# EAGLE design project2 (EAGLE 9.6.2)
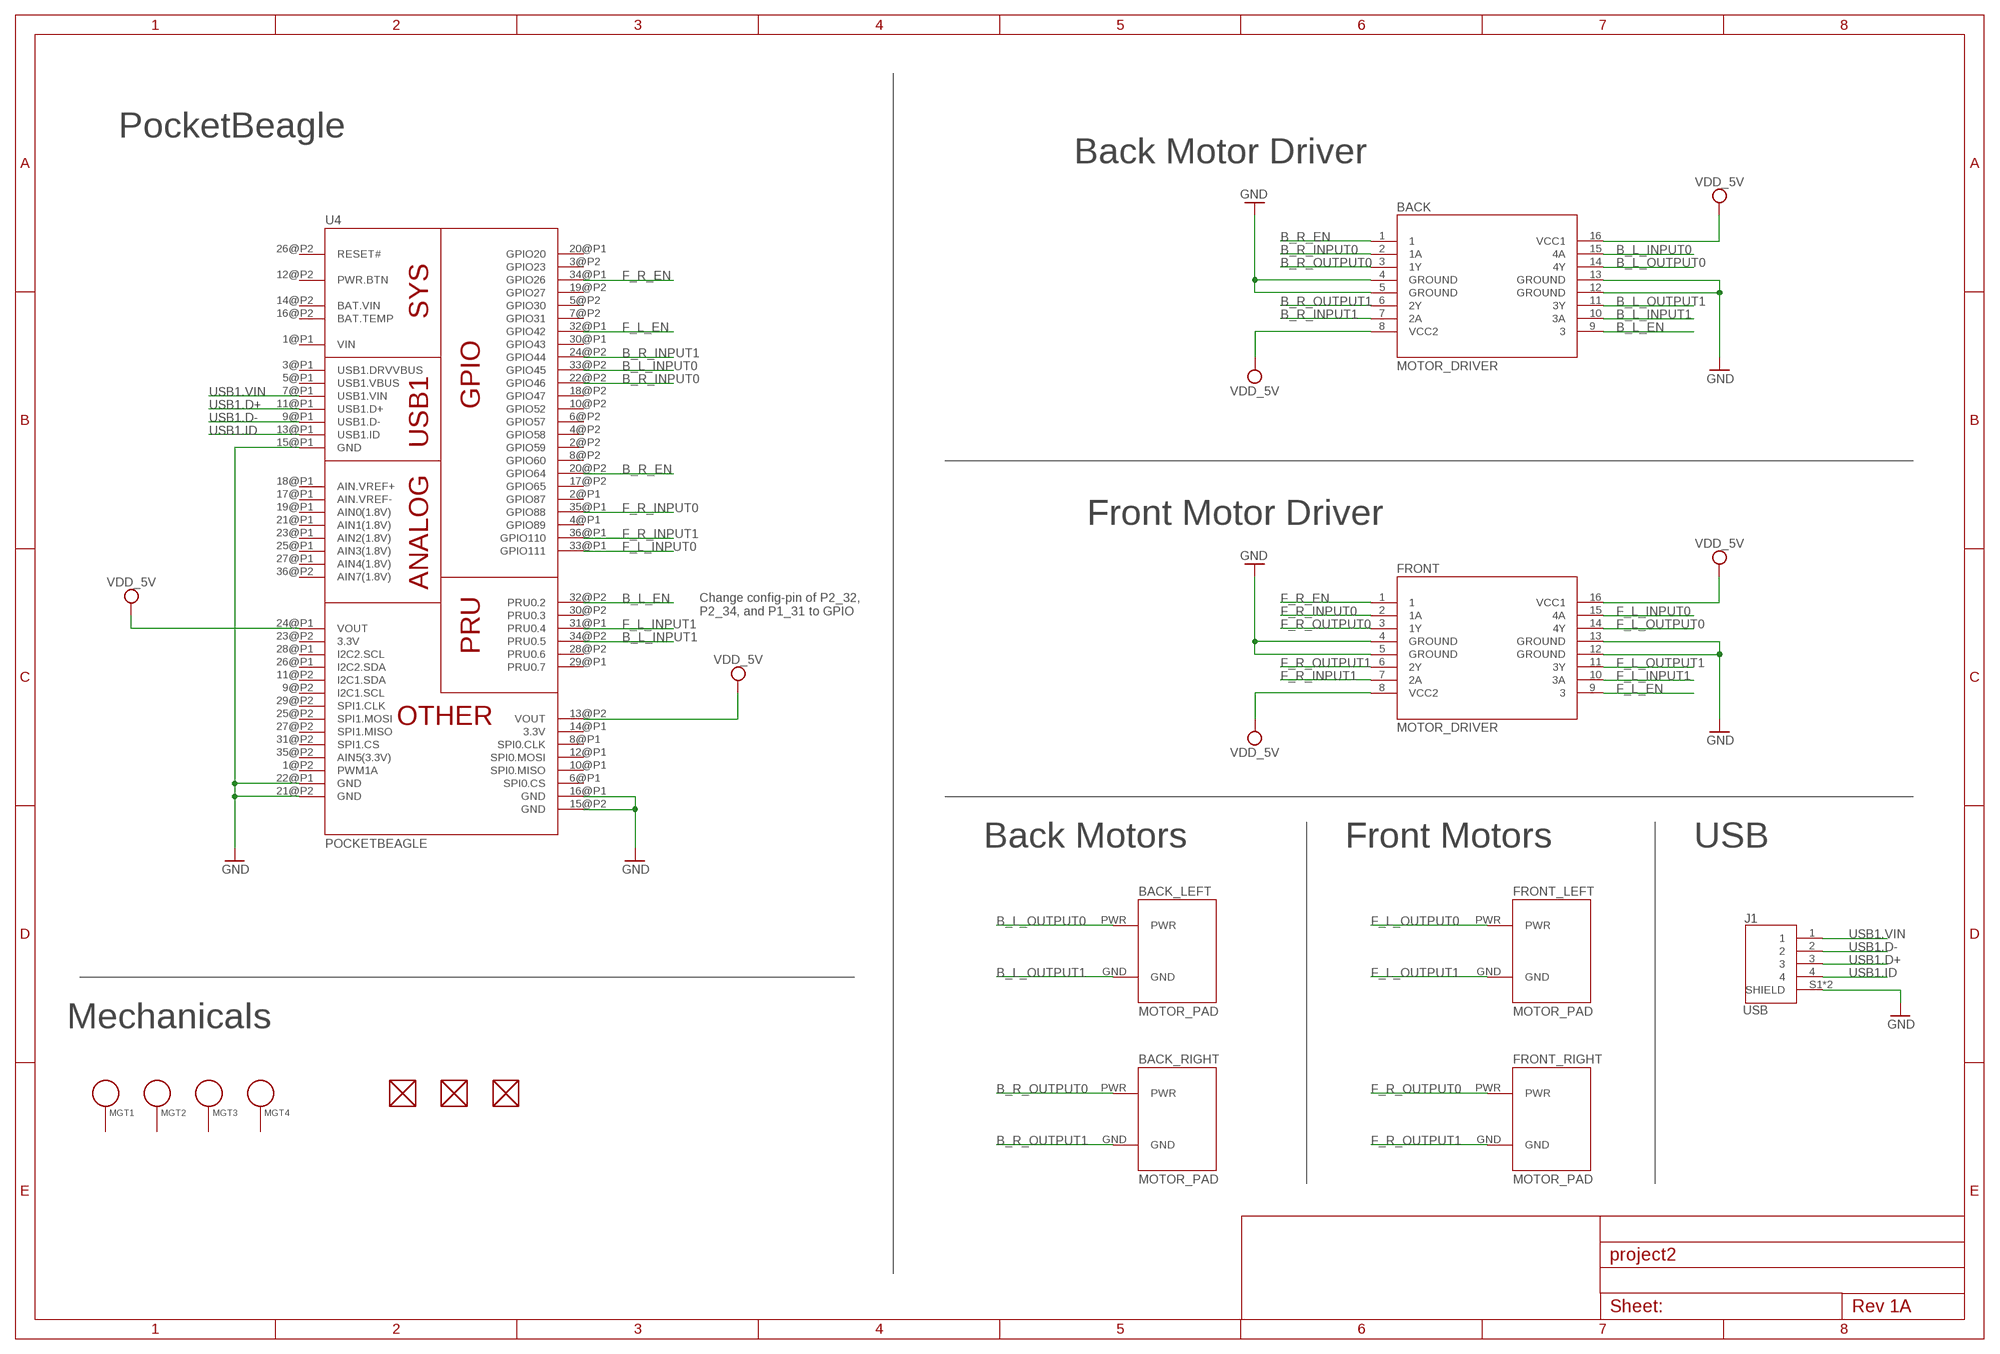
[diagram p0: schematic, sheet 1]

## Parts
BACK  MOTOR_DRIVER  [MOTOR_DRIVER]
BACK_LEFT  MOTOR_PAD  [MOTOR_PAD]
BACK_RIGHT  MOTOR_PAD  [MOTOR_PAD]
FRONT  MOTOR_DRIVER  [MOTOR_DRIVER]
FRONT_LEFT  MOTOR_PAD  [MOTOR_PAD]
FRONT_RIGHT  MOTOR_PAD  [MOTOR_PAD]
FUD1  FIDUCIAL  [FIDUCIAL_40MIL]
FUD2  FIDUCIAL  [FIDUCIAL_40MIL]
FUD3  FIDUCIAL  [FIDUCIAL_40MIL]
J1  USB  [J_SMD_292303-9-4_2,2.5_14.85_14.06_8.9]
MGT1  MOUNTING_HOLE  [MOUNTING_HOLE]
MGT2  MOUNTING_HOLE  [MOUNTING_HOLE]
MGT3  MOUNTING_HOLE  [MOUNTING_HOLE]
MGT4  MOUNTING_HOLE  [MOUNTING_HOLE]
U4  POCKETBEAGLE  [POCKETBEAGLE]

## Nets
B_L_EN: BACK.9 U4.32@P2(PRU0.2)
B_L_INPUT0: BACK.15(4A) U4.33@P2(GPIO45)
B_L_INPUT1: BACK.10(3A) U4.34@P2(PRU0.5)
B_L_OUTPUT0: BACK.14(4Y) BACK_LEFT.PWR
B_L_OUTPUT1: BACK.11(3Y) BACK_LEFT.GND
B_R_EN: BACK.1 U4.20@P2(GPIO64)
B_R_INPUT0: BACK.2(1A) U4.22@P2(GPIO46)
B_R_INPUT1: BACK.7(2A) U4.24@P2(GPIO44)
B_R_OUTPUT0: BACK.3(1Y) BACK_RIGHT.PWR
B_R_OUTPUT1: BACK.6(2Y) BACK_RIGHT.GND
F_L_EN: FRONT.9 U4.32@P1(GPIO42)
F_L_INPUT0: FRONT.15(4A) U4.33@P1(GPIO111)
F_L_INPUT1: FRONT.10(3A) U4.31@P1(PRU0.4)
F_L_OUTPUT0: FRONT.14(4Y) FRONT_LEFT.PWR
F_L_OUTPUT1: FRONT.11(3Y) FRONT_LEFT.GND
F_R_EN: FRONT.1 U4.34@P1(GPIO26)
F_R_INPUT0: FRONT.2(1A) U4.35@P1(GPIO88)
F_R_INPUT1: FRONT.7(2A) U4.36@P1(GPIO110)
F_R_OUTPUT0: FRONT.3(1Y) FRONT_RIGHT.PWR
F_R_OUTPUT1: FRONT.6(2Y) FRONT_RIGHT.GND
GND: BACK.4(GROUND) BACK.5(GROUND) BACK.12(GROUND) BACK.13(GROUND) FRONT.4(GROUND) FRONT.5(GROUND) FRONT.12(GROUND) FRONT.13(GROUND) J1.S1(SHIELD) J1.S2(SHIELD) U4.15@P1(GND) U4.15@P2(GND) U4.16@P1(GND) U4.21@P2(GND) U4.22@P1(GND)
USB1.D+: J1.3 U4.11@P1(USB1.D+)
USB1.D-: J1.2 U4.9@P1(USB1.D-)
USB1.ID: J1.4 U4.13@P1(USB1.ID)
USB1.VIN: J1.1 U4.7@P1(USB1.VIN)
VDD_5V: BACK.8(VCC2) BACK.16(VCC1) FRONT.8(VCC2) FRONT.16(VCC1) U4.13@P2(VOUT) U4.24@P1(VOUT)
Unconnected: FUD1.P$1 FUD2.P$1 FUD3.P$1 MGT1.P$1 MGT2.P$1 MGT3.P$1 MGT4.P$1 U4.1@P2(PWM1A) U4.2@P1(GPIO87) U4.2@P2(GPIO59) U4.3@P1(USB1.DRVVBUS) U4.3@P2(GPIO23) U4.4@P1(GPIO89) U4.4@P2(GPIO58) U4.5@P1(USB1.VBUS) U4.5@P2(GPIO30) U4.6@P1(SPI0.CS) U4.6@P2(GPIO57) U4.7@P2(GPIO31) U4.8@P1(SPI0.CLK) U4.8@P2(GPIO60) U4.9@P2(I2C1.SCL) U4.10@P1(SPI0.MISO) U4.10@P2(GPIO52) U4.11@P2(I2C1.SDA) U4.12@P1(SPI0.MOSI) U4.12@P2(PWR.BTN) U4.14@P1(3.3V) U4.16@P2(BAT.TEMP) U4.17@P1(AIN.VREF-) U4.17@P2(GPIO65) U4.18@P1(AIN.VREF+) U4.18@P2(GPIO47) U4.19@P1(AIN0(1.8V)) U4.19@P2(GPIO27) U4.20@P1(GPIO20) U4.21@P1(AIN1(1.8V)) U4.23@P1(AIN2(1.8V)) U4.23@P2(3.3V) U4.25@P1(AIN3(1.8V)) U4.25@P2(SPI1.MOSI) U4.26@P1(I2C2.SDA) U4.26@P2(RESET#) U4.27@P1(AIN4(1.8V)) U4.27@P2(SPI1.MISO) U4.28@P1(I2C2.SCL) U4.28@P2(PRU0.6) U4.29@P1(PRU0.7) U4.29@P2(SPI1.CLK) U4.30@P1(GPIO43) U4.30@P2(PRU0.3) U4.31@P2(SPI1.CS) U4.35@P2(AIN5(3.3V)) U4.36@P2(AIN7(1.8V))

## Notes on the sheet
- PocketBeagle
- Back Motor Driver
- Front Motor Driver
- Change config-pin of P2_32,
  P2_34, and P1_31 to GPIO
- Back Motors | Front Motors | USB
- Mechanicals

## Power pins joined to a net without a drawn wire
BAT.VIN: U4.14@P2(BAT.VIN)
VIN: U4.1@P1(VIN)

## Library data of the parts
BACK FRONT = project2:MOTOR_DRIVER; DATASHEET_URL: http://www.ti.com/lit/gpn/L293D; DESCRIPTION: Quadruple Half-H Drivers; FAMILY_NAME: PERIPHERAL DRIVER AND ACTUATOR; GENERIC_PART_NUMBER: L293D; INDUSTRY_STD_PKG_TYPE: PDIP; MANUFACTURER: Texas Instruments; PACKAGE_DESIGNATOR: NE; PIN_COUNT: 16
BACK_LEFT BACK_RIGHT FRONT_LEFT FRONT_RIGHT = project2:MOTOR_PAD
FUD1-FUD3 = project2:FIDUCIAL
J1 = project2:USB: Conn USB 2.0 Type A RCP 4 POS Solder RA SMD 4 Terminal 1 Port Automotive Box/Reel/Tray Check prices <https://pricing.snapeda.com/parts/292303-9/TE%20Connectivity/view-part?ref=eda>; AVAILABILITY: Good; CENTERLINE_PITCH: 2 mm[.078 in]; COMMENT: 292303-9; DESCRIPTION: Conn USB 2.0 Type A RCP 4 POS Solder RA Thru-Hole 4 Terminal 1 Port Automotive Tray; EU_ROHS_COMPLIANCE: Compliant; MF: TE Connectivity; MP: 292303-9; NUMBER_OF_POSITIONS: 4; PACKAGE: None; PRICE: None; PRODUCT_TYPE: Connector; PURCHASE-URL: https://pricing.snapeda.com/search/part/292303-9/?ref=eda
MGT1-MGT4 = project2:MOUNTING_HOLE: Chassis Mounting Hole w/GND connection ability
U4 = project2:POCKETBEAGLE

## Board
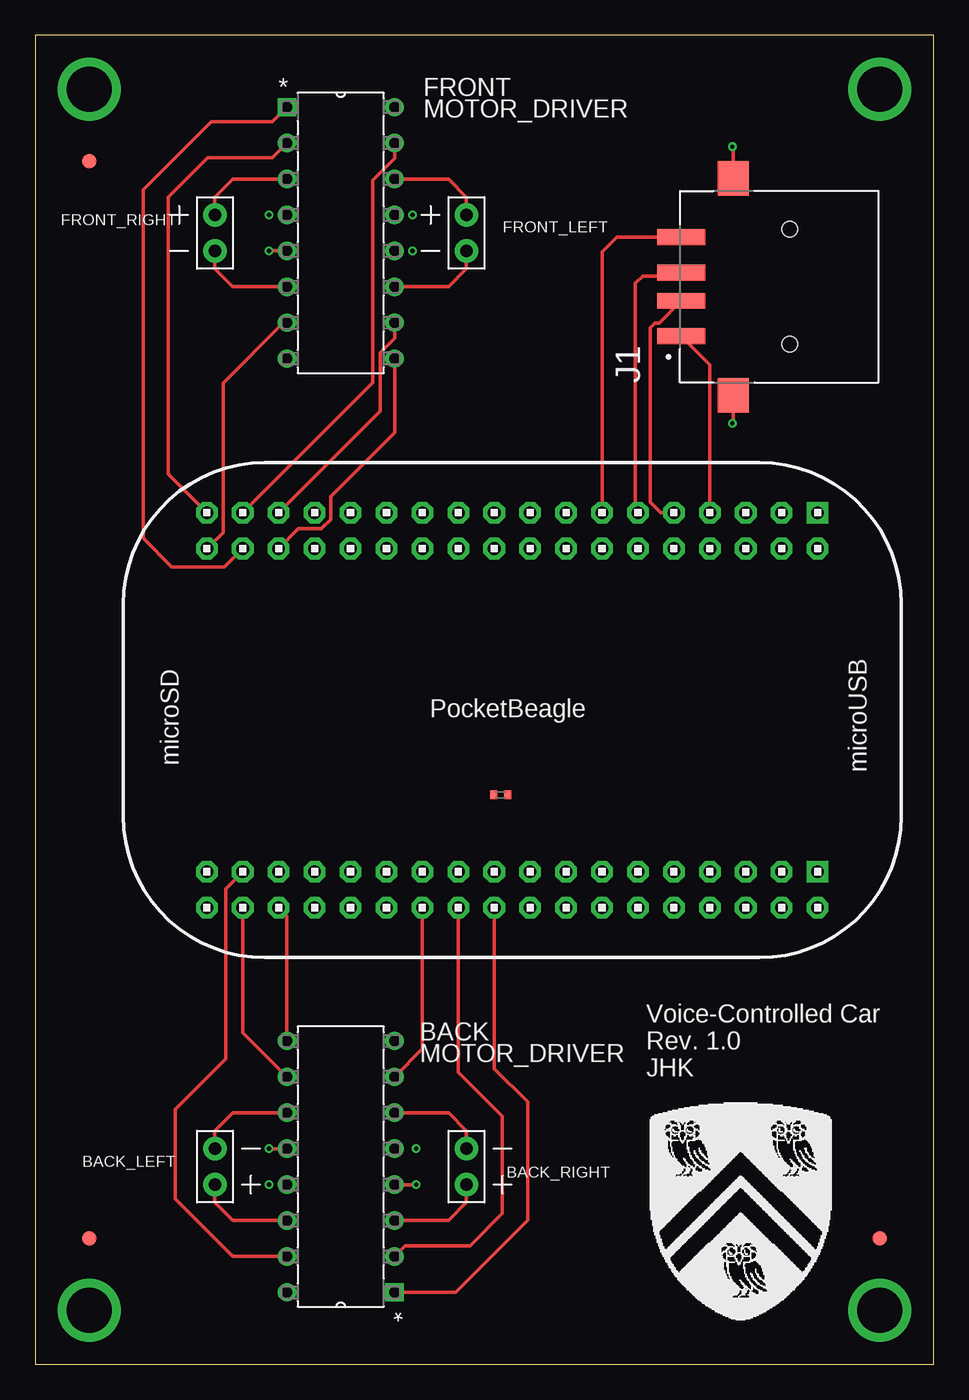
[diagram p1: board, top side]
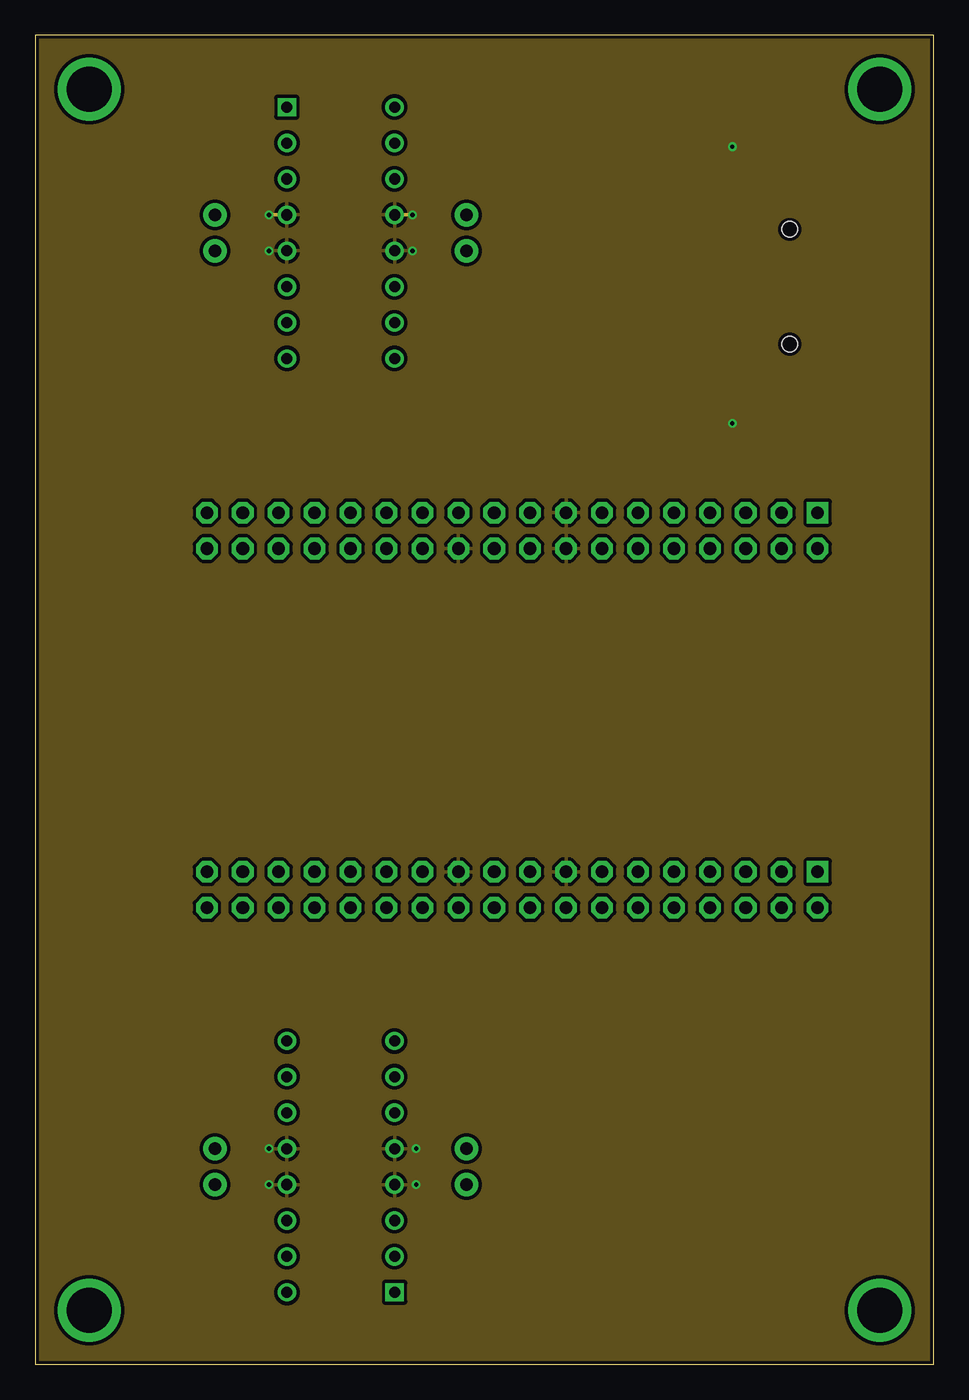
[diagram p2: board, inner layer Route2]
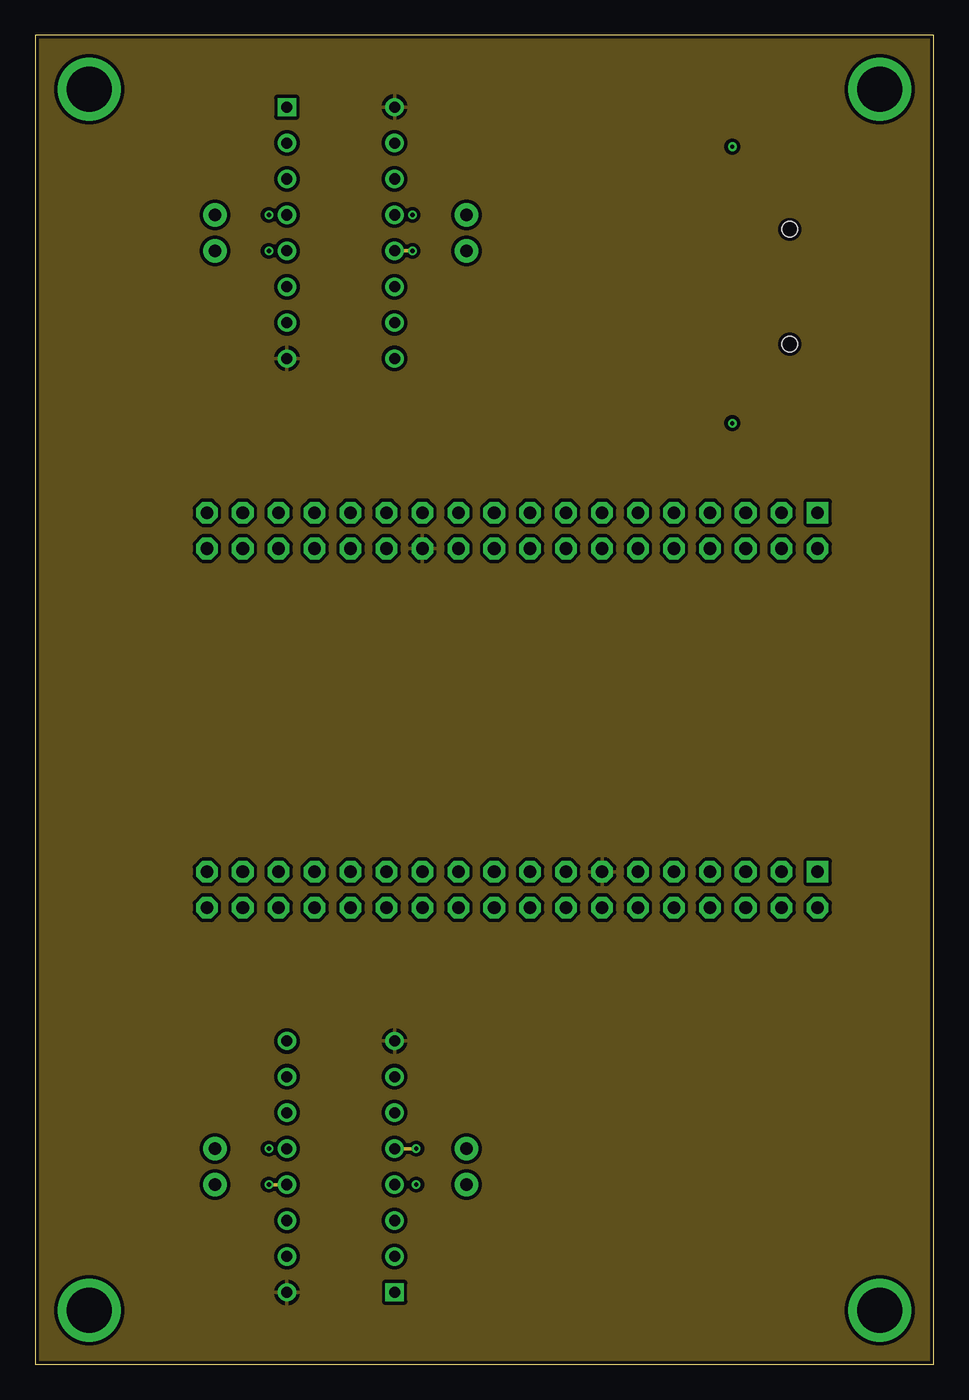
[diagram p3: board, inner layer Route15]

Size 63.5 x 93.98 mm. Coordinates in mm from the lower left corner, seen from the top.
Outline: 0,0 63.5,0 63.5,93.98 0,93.98 0,0
Copper layers (1*2*15*16): Top 0.035mm / dielectric 0.23mm / Route2 0.035mm / dielectric 0.93mm / Route15 0.035mm / dielectric 0.23mm / Bottom 0.035mm
Design rules "ENGI301_4lyr": minimum track width 10mil, minimum drill 12mil, track to track 10mil, track to pad 10mil, pad to pad 10mil, via to via 10mil, smd to smd 10mil, copper to edge 10mil, drill to drill 12mil, minimum pad ring 6mil, minimum via ring 6mil, stop-mask expansion 3mil, vias tented up to drill 25mil, thermal gap 10mil

### Footprints (pad centres in the part's own frame; a part is rotated, then mirrored left to right if it is on the bottom)
MOTOR_DRIVER = drill 0.787 pad 1.295 square: 1 -7.62,17.78 | drill 0.787 pad 1.295: 2 -7.62,15.24; 3 -7.62,12.7; 4 -7.62,10.16; 5 -7.62,7.62; 6 -7.62,5.08; 7 -7.62,2.54; 8 -7.62,0; 9 0,0; 10 0,2.54; 11 0,5.08; 12 0,7.62; 13 0,10.16; 14 0,12.7; 15 0,15.24; 16 0,17.78
MOTOR_PAD = drill 0.889 pad 1.651: GND 0,-2.54; PWR 0,0
FIDUCIAL_40MIL = smd 1.016 x 1.016: P$1 0,0
J_SMD_292303-9-4_2,2.5_14.85_14.06_8.9 = smd 1.12 x 3.39: 1 -3.5,7.68; 2 -1,7.68; 3 1,7.68; 4 3.5,7.68 | smd 2.44 x 2.22: S1 -7.67,4; S2 7.67,4 | hole 1.1: -4.06,0; 4.06,0
MOUNTING_HOLE = drill 3.175 pad 4.445: P$1 0,0
POCKETBEAGLE = smd 0.5 x 0.6: 1 27.821,23.495; 2 28.821,23.495 | drill 0.889 pad 1.524 square: 1@P1 5.91,3.53; 1@P2 5.91,28.93 | drill 0.889 pad 1.524 octagon: 2@P1 5.91,6.07; 2@P2 5.91,31.47; 3@P1 8.45,3.53; 3@P2 8.45,28.93; 4@P1 8.45,6.07; 4@P2 8.45,31.47; 5@P1 10.99,3.53; 5@P2 10.99,28.93; 6@P1 10.99,6.07; 6@P2 10.99,31.47; 7@P1 13.53,3.53; 7@P2 13.53,28.93; 8@P1 13.53,6.07; 8@P2 13.53,31.47; 9@P1 16.07,3.53; 9@P2 16.07,28.93; 10@P1 16.07,6.07; 10@P2 16.07,31.47; 11@P1 18.61,3.53; 11@P2 18.61,28.93; 12@P1 18.61,6.07; 12@P2 18.61,31.47; 13@P1 21.15,3.53; 13@P2 21.15,28.93; 14@P1 21.15,6.07; 14@P2 21.15,31.47; 15@P1 23.69,3.53; 15@P2 23.69,28.93; 16@P1 23.69,6.07; 16@P2 23.69,31.47; 17@P1 26.23,3.53; 17@P2 26.23,28.93; 18@P1 26.23,6.07; 18@P2 26.23,31.47; 19@P1 28.77,3.53; 19@P2 28.77,28.93; 20@P1 28.77,6.07; 20@P2 28.77,31.47; 21@P1 31.31,3.53; 21@P2 31.31,28.93; 22@P1 31.31,6.07; 22@P2 31.31,31.47; 23@P1 33.85,3.53; 23@P2 33.85,28.93; 24@P1 33.85,6.07; 24@P2 33.85,31.47; 25@P1 36.39,3.53; 25@P2 36.39,28.93; 26@P1 36.39,6.07; 26@P2 36.39,31.47; 27@P1 38.93,3.53; 27@P2 38.93,28.93; 28@P1 38.93,6.07; 28@P2 38.93,31.47; 29@P1 41.47,3.53; 29@P2 41.47,28.93; 30@P1 41.47,6.07; 30@P2 41.47,31.47; 31@P1 44.01,3.53; 31@P2 44.01,28.93; 32@P1 44.01,6.07; 32@P2 44.01,31.47; 33@P1 46.55,3.53; 33@P2 46.55,28.93; 34@P1 46.55,6.07; 34@P2 46.55,31.47; 35@P1 49.09,3.53; 35@P2 49.09,28.93; 36@P1 49.09,6.07; 36@P2 49.09,31.47

### Placement (x,y rotation side)
BACK  17.78,22.86 180 top
BACK_LEFT  12.7,12.7 180 top
BACK_RIGHT  30.48,12.7 180 top
FRONT  25.4,71.12 0 top
FRONT_LEFT  30.48,81.28 0 top
FRONT_RIGHT  12.7,81.28 0 top
FUD1  3.81,8.89 0 top
FUD2  59.69,8.89 0 top
FUD3  3.81,85.09 0 top
J1  53.34,76.2 90 top
MGT1  3.81,3.81 0 top
MGT2  59.69,3.81 0 top
MGT3  59.69,90.17 0 top
MGT4  3.81,90.17 0 top
U4  61.21,63.75 180 top

### Tracks (layer width: path | path; a pad name or v marks a point on that pad's centre or on a via)
B_L_EN
  Top 0.254: U4.32@P2 17.78,31.71 BACK.9
B_L_INPUT0
  Top 0.254: BACK.15 13.97,7.62 9.91,11.68 9.91,18.03 13.46,21.59 13.46,33.62 U4.33@P2
B_L_INPUT1
  Top 0.254: U4.34@P2 14.66,23.44 BACK.10
B_L_OUTPUT0
  Top 0.254: BACK_LEFT.PWR 12.7,11.43 13.97,10.16 BACK.14
B_L_OUTPUT1
  Top 0.254: BACK.11 13.97,17.78 12.7,16.51 BACK_LEFT.GND
B_R_EN
  Top 0.254: U4.20@P2 32.44,20.9 34.8,18.54 34.8,10.16 29.72,5.08 BACK.1
B_R_INPUT0
  Top 0.254: BACK.2 26.16,8.38 30.73,8.38 33.02,10.67 33.02,17.53 29.9,20.64 U4.22@P2
B_R_INPUT1
  Top 0.254: U4.24@P2 27.36,22.28 BACK.7
B_R_OUTPUT0
  Top 0.254: BACK.3 29.21,10.16 30.48,11.43 BACK_RIGHT.PWR
B_R_OUTPUT1
  Top 0.254: BACK.6 29.21,17.78 30.48,16.51 BACK_RIGHT.GND
F_L_EN
  Top 0.254: FRONT.9 25.4,65.88 20.89,61.37 20.89,59.75 20.22,59.08 18.6,59.08 U4.32@P1
F_L_INPUT0
  Top 0.254: U4.33@P1 23.86,69.42 23.86,83.74 25.4,85.28 FRONT.15
F_L_INPUT1
  Top 0.254: FRONT.10 25.4,72.58 24.37,71.55 24.37,67.39 U4.31@P1
F_L_OUTPUT0
  Top 0.254: FRONT.14 29.21,83.82 30.48,82.55 FRONT_LEFT.PWR
F_L_OUTPUT1
  Top 0.254: FRONT_LEFT.GND 30.48,77.47 29.21,76.2 FRONT.11
F_R_EN
  Top 0.254: FRONT.1 16.76,87.88 12.45,87.88 7.62,83.06 7.62,58.42 9.65,56.39 13.37,56.39 U4.34@P1
F_R_INPUT0
  Top 0.254: FRONT.2 16.76,85.34 12.19,85.34 9.4,82.55 9.4,62.95 U4.35@P1
F_R_INPUT1
  Top 0.254: FRONT.7 17.53,73.66 13.27,69.4 13.27,58.83 U4.36@P1
F_R_OUTPUT0
  Top 0.254: FRONT.3 13.97,83.82 12.7,82.55 FRONT_RIGHT.PWR
F_R_OUTPUT1
  Top 0.254: FRONT_RIGHT.GND 12.7,77.47 13.97,76.2 FRONT.6
GND  (via drill 0.3 pad 0.61)
  Top 0.254: BACK.4 v26.92,12.7 | BACK.12 v16.51,15.24 | J1.S1 49.34,66.61 v49.28,66.55 | J1.S2 49.34,86.04 v49.28,86.11 | FRONT.5 v16.51,78.74
  Route2 0.254: FRONT.4 v16.51,81.28 | FRONT.13 v26.67,81.28
  Route15 0.254: v26.92,15.24 BACK.5 | BACK.13 v16.51,12.7 | FRONT.12 v26.67,78.74
  pour Route2: -2.54,-2.54 -2.54,96.52 66.04,96.52 66.04,-2.54
USB1.D+
  Top 0.254: J1.3 45.42,76.96 42.93,76.96 42.42,76.45 42.42,60.41 U4.11@P1
USB1.D-
  Top 0.254: J1.2 44.1,73.64 43.81,73.64 43.46,73.29 43.46,60.98 44.22,60.22 U4.9@P1
USB1.ID
  Top 0.254: J1.4 41.09,79.7 40.06,78.67 U4.13@P1
USB1.VIN
  Top 0.254: J1.1 47.68,70.68 U4.7@P1
VDD_5V
  pour Route15: -5.08,-5.08 -5.08,99.06 68.58,99.06 68.58,-5.08

### Text on the board
tPlace: Voice-Controlled Car | Rev. 1.0 | JHK